# EasyEDA Pro project Pipscat_full_color_Saintcon Minibadge.epro

# Schematic Saintcon Minibadge
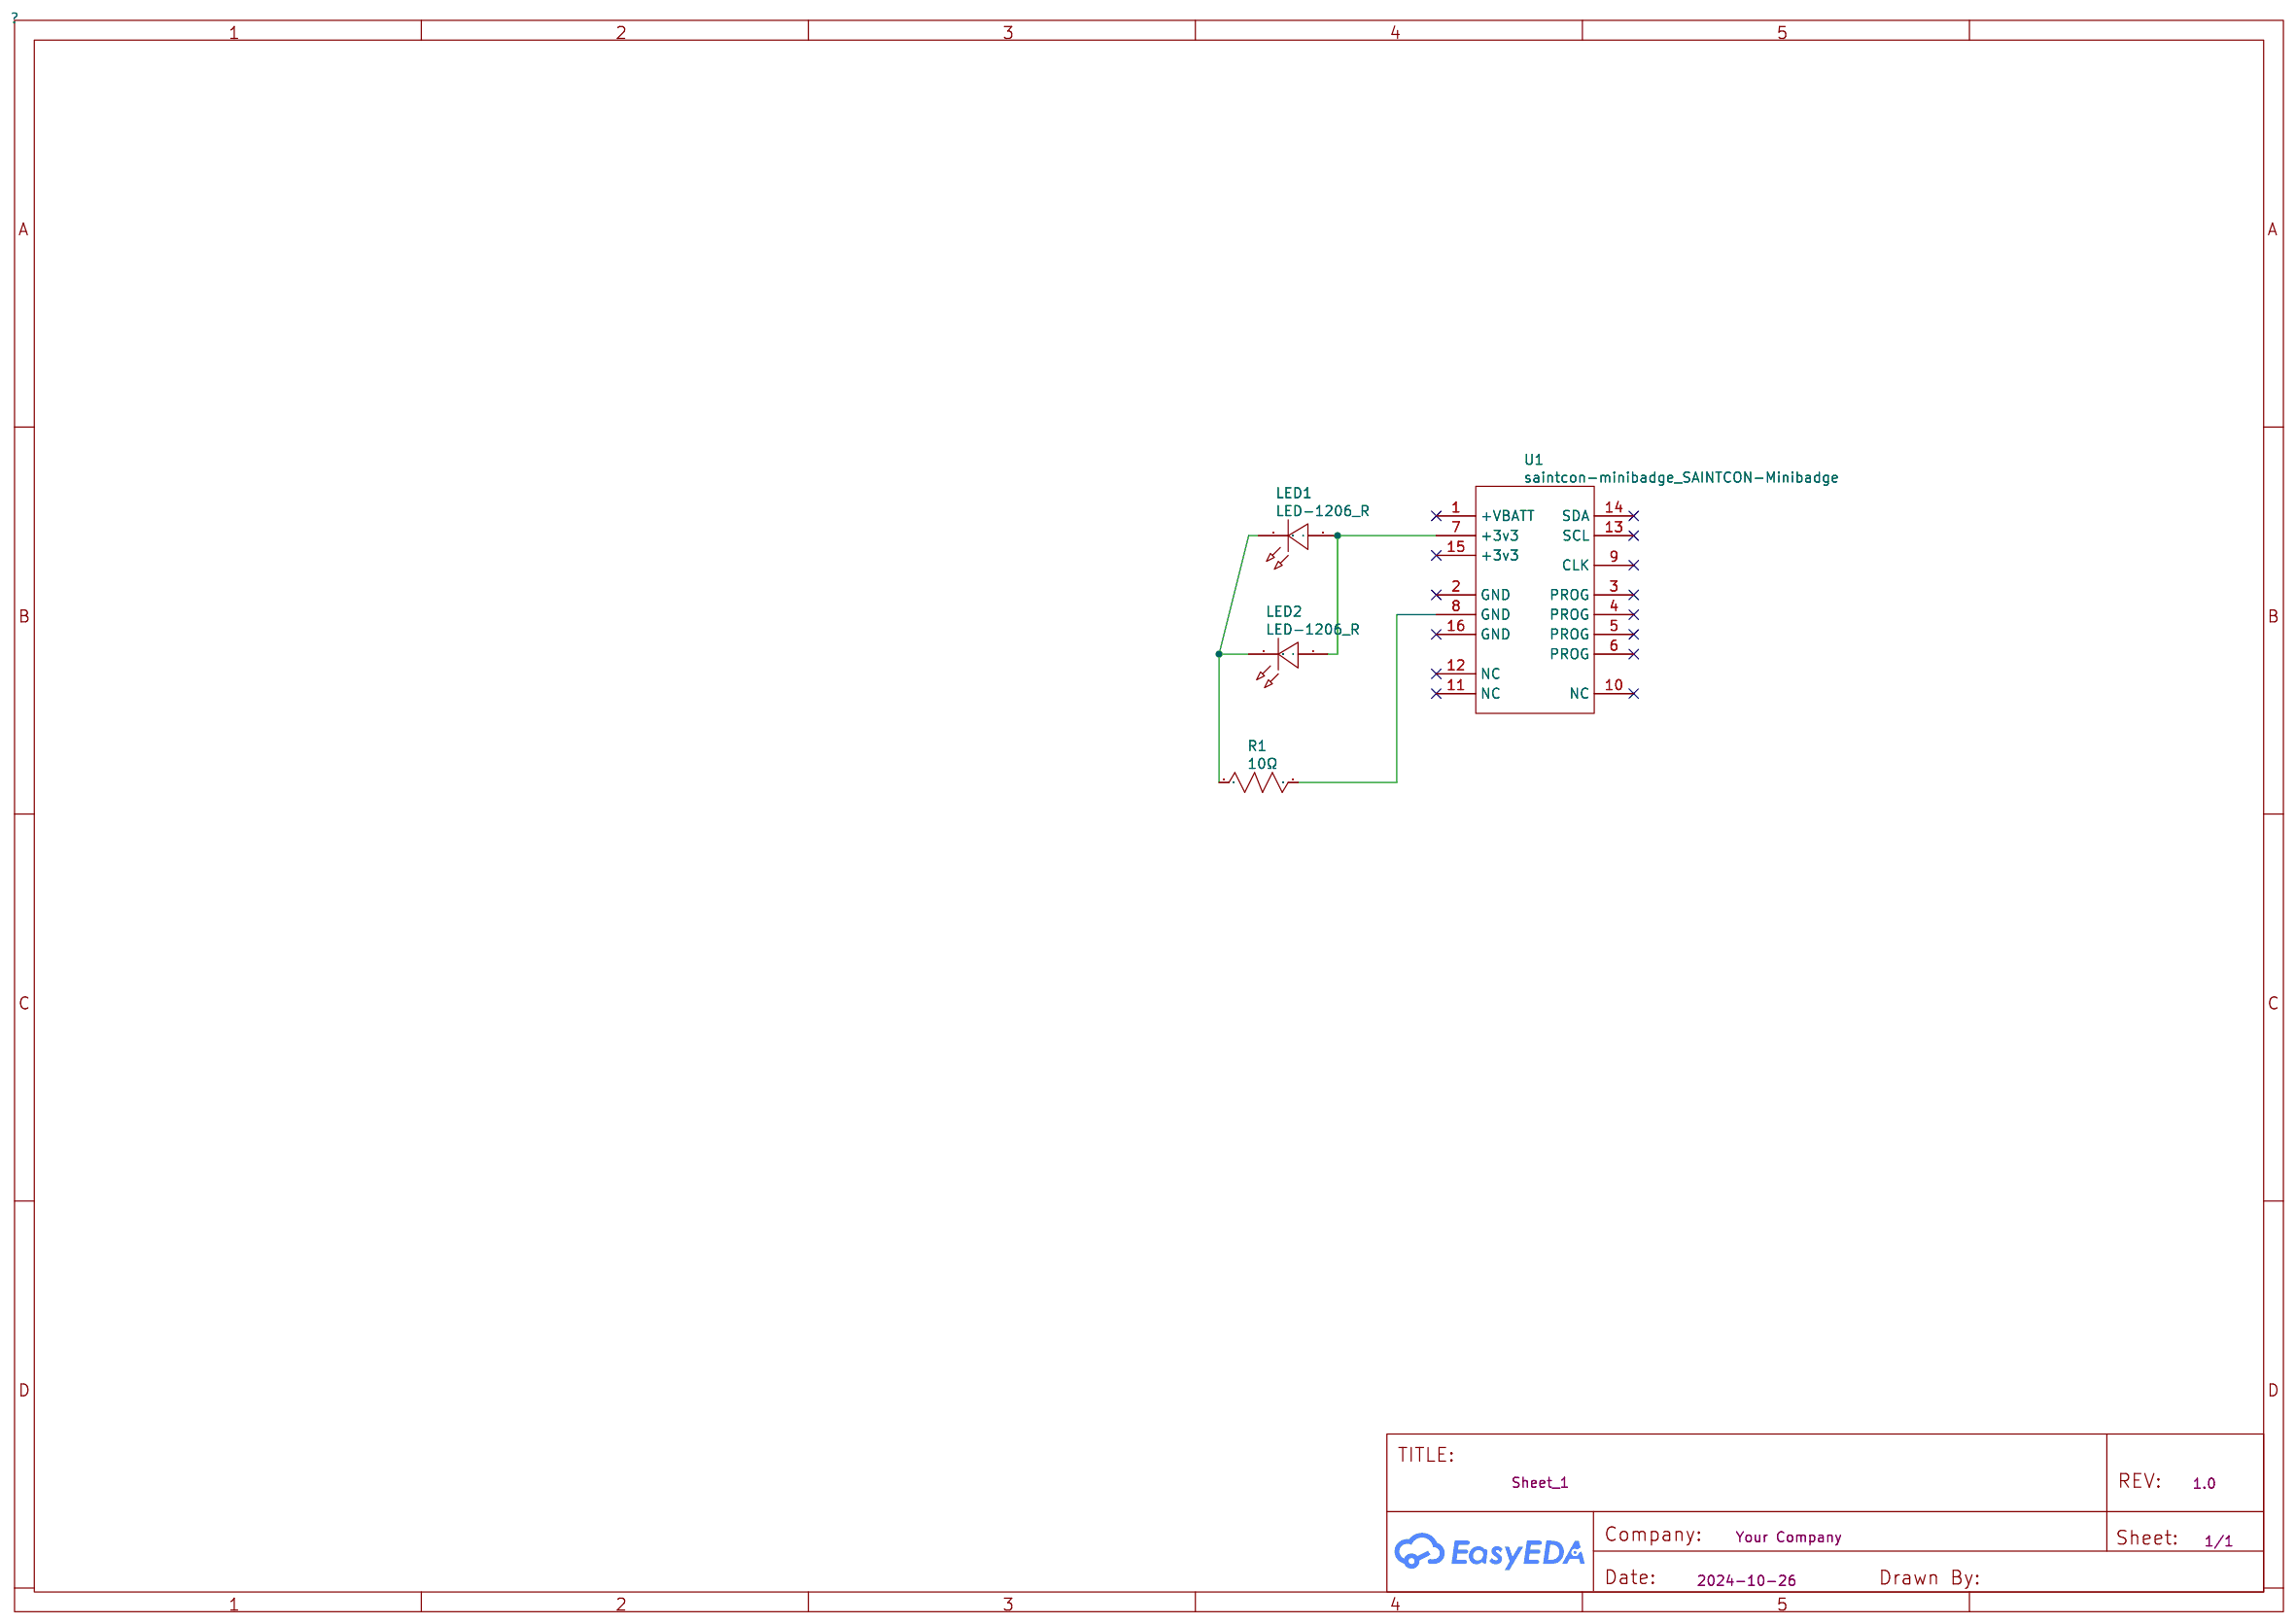
[diagram p0: schematic sheet]

## Parts
LED1  LED-1206_R  [LED_1206]
LED2  LED-1206_R  [LED_1206]
R1  10Ω  [R1206]
U1  saintcon-minibadge_SAINTCON-Minibadge  [SAINTCON-MINIBADGE]  (no BOM)

## Library data of the parts
LED1 LED2 = LED-1206_R: license: https://www.gnu.org/licenses/lgpl-2.1.html; Supplier: LCSC
R1 = 10Ω: Supplier: LCSC
U1 = saintcon-minibadge_SAINTCON-Minibadge

## Nets
LED1_1: LED1.1(2) LED2.1(2) R1.1
U1_7: LED1.2(1) LED2.2(1) U1.7(+3v3)
U1_8: R1.2 U1.8(GND)

Not connected (* = marked no-connect by the designer): U1 1(+VBATT)* 2(GND)* 3(PROG)* 4(PROG)* 5(PROG)* 6(PROG)* 9(CLK)* 10(NC)* 11(NC)* 12(NC)* 13(SCL)* 14(SDA)* 15(+3v3)* 16(GND)*

# Board PCB_Saintcon Minibadge_2
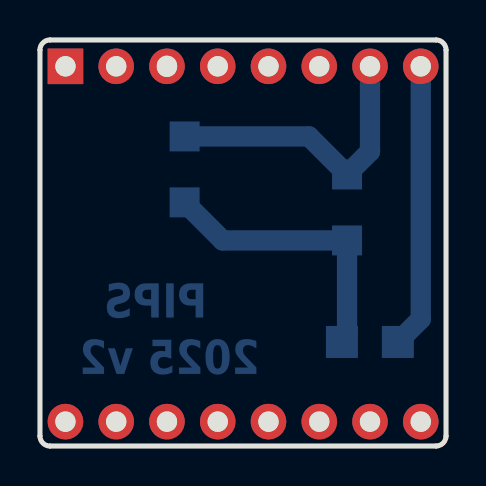
[diagram p1: board, top side]
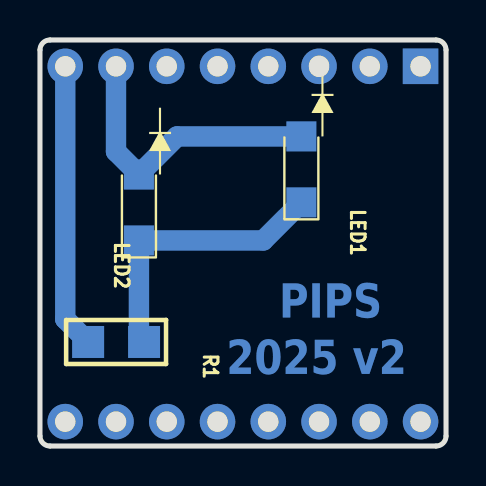
[diagram p2: board, bottom side, seen from below]

Outline 20.32 x 20.32 mm; copper layers: Top Layer, Bottom Layer. Coordinates in mm from the lower left corner of the outline.
Outline path: 0,19.82 arc(0.15,20.17) 0.5,20.32 19.82,20.32 arc(20.17,20.17) 20.32,19.82 20.32,0.5 arc(20.17,0.15) 19.82,0 0.5,0 arc(0.15,0.15) 0,0.5 0,19.82
Stack: Top Layer 0.035mm / Dielectric1 1.51mm FR4 er 4.5 / Bottom Layer 0.035mm

## Design rules (mm)
spacing Default (default): track to track 0.152, other pairs 0 to 0.152
track width Default (default): min 0.254, default 0.254, max 25.4
differential pair differentialPair (default): width min 0.127, default 0.254, max 2.54; gap min 0.152, default 0.152
via Default (default): diameter min 0.61, default 0.61, max 100.025; hole min 0.305, default 0.305, max 59.995

## Placement (name value [footprint] x y rotation side)
LED1  LED-1206_R  [LED_1206]  15.37 11.94 90 bottom
LED2  LED-1206_R  [LED_1206]  7.24 13.84 90 bottom
R1  10Ω  [R1206]  16.51 5.21 0 bottom
U1  saintcon-minibadge_SAINTCON-Minibadge  [SAINTCON-MINIBADGE]  -123.82 101.74 0 top

## Footprints (pads in the part's own frame, mm; a bottom-side part is the same pattern mirrored in y, then rotated)
LED_1206
  rect 1.5x1.5 smd: 1(-1.65,0) 2(1.65,0)
R1206
  rect 1.6x1.6 smd: 1(-1.399,0) 2(1.399,0)
SAINTCON-MINIBADGE
  rect 1.778x1.778 hole 1.016x1.021: 1(125.1,-82.74)
  round 1.778 hole 1.016x1.021: 2(127.64,-82.74) 4(132.72,-82.74) 5(135.26,-82.74) 6(137.8,-82.74) 7(140.34,-82.74) 8(142.88,-82.74) 9(125.1,-100.519) 10(127.64,-100.519) 11(130.18,-100.519) 12(132.72,-100.519) 13(135.26,-100.519) 14(137.8,-100.519) 15(140.34,-100.519) 16(142.88,-100.519)
  round 1.778 hole 1.016x1.067: 3(130.18,-82.74)

## Nets
As in the schematic.

Pads without a net: U1 1 2 3 4 5 6 9 10 11 12 13 14 15 16

## Routing (per net, layer and track width the routed paths; a pad name or vN(x,y) marks a point on that pad's centre or on a via; arc(x,y) is an arc through that point)
LED1_1: length 14.1
  Bottom Layer w1.016: LED2.1 9.14,10.29 15.37,10.29 15.37,5.46 R1.1
U1_7: length 14.8
  Bottom Layer w1.016: LED2.2 13.46,15.49 LED1.2 16.52,14.74 U1.7
U1_8: length 14.3
  Bottom Layer w1.016: U1.8 19.06,6.35 R1.2

## Text on the board
Bottom Layer: PIPS / 2025 v2
Bottom Solder Mask Layer: PIPS / 2025 v2
